# EAGLE schematic mega_simplest_classboard_redux (EAGLE 6.5.0)
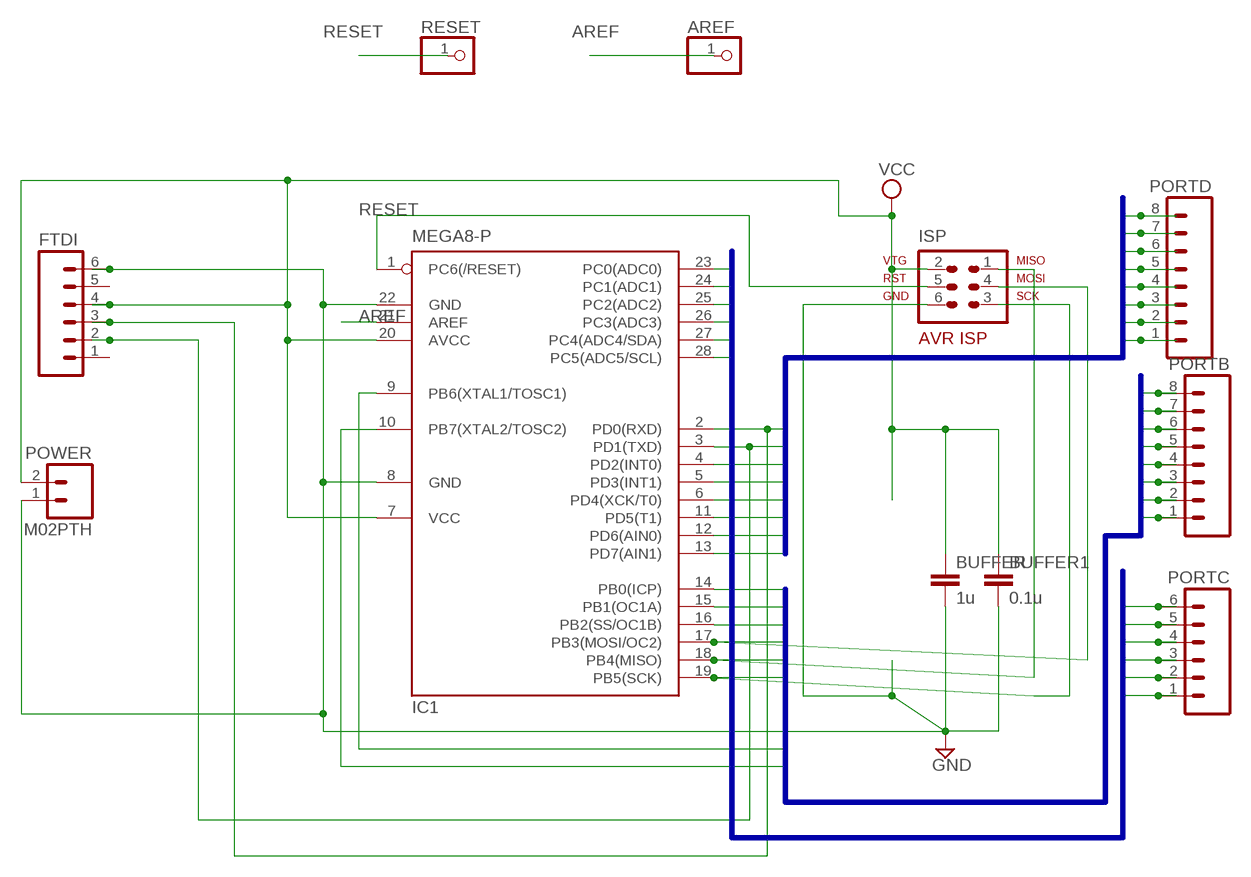
[diagram p0: schematic, sheet 1]

## Parts
AREF  PINHD-1X1  [1X01]
BUFFER  1u  C5/3.5  [C5B3.5]
BUFFER1  0.1u  C5/3.5  [C5B3.5]
FTDI  M06SIP  [1X06]
IC1  MEGA8-P  [DIL28-3]
ISP  AVR-ISP-6  [AVR-ISP-6]
PORTB  M081X08  [1X08]
PORTC  M06SIP  [1X06]
PORTD  M081X08  [1X08]
POWER  M02PTH  [1X02]
RESET  PINHD-1X1  [1X01]

## Nets
AREF: AREF.1 IC1.21(AREF)
GND: BUFFER1.2 BUFFER.2 FTDI.6 IC1.8(GND) IC1.22(GND) ISP.6 POWER.1
PORTB0: IC1.14(PB0(ICP)) PORTB.8
PORTB1: IC1.15(PB1(OC1A)) PORTB.7
PORTB2: IC1.16(PB2(SS/OC1B)) PORTB.6
PORTB3: IC1.17(PB3(MOSI/OC2)) ISP.4 PORTB.5
PORTB4: IC1.18(PB4(MISO)) ISP.1 PORTB.4
PORTB5: IC1.19(PB5(SCK)) ISP.3 PORTB.3
PORTB6: IC1.9(PB6(XTAL1/TOSC1)) PORTB.2
PORTB7: IC1.10(PB7(XTAL2/TOSC2)) PORTB.1
PORTC0: IC1.23(PC0(ADC0)) PORTC.6
PORTC1: IC1.24(PC1(ADC1)) PORTC.5
PORTC2: IC1.25(PC2(ADC2)) PORTC.4
PORTC3: IC1.26(PC3(ADC3)) PORTC.3
PORTC4: IC1.27(PC4(ADC4/SDA)) PORTC.2
PORTC5: IC1.28(PC5(ADC5/SCL)) PORTC.1
PORTD0: FTDI.3 IC1.2(PD0(RXD)) PORTD.8
PORTD1: FTDI.2 IC1.3(PD1(TXD)) PORTD.7
PORTD2: IC1.4(PD2(INT0)) PORTD.6
PORTD3: IC1.5(PD3(INT1)) PORTD.5
PORTD4: IC1.6(PD4(XCK/T0)) PORTD.4
PORTD5: IC1.11(PD5(T1)) PORTD.3
PORTD6: IC1.12(PD6(AIN0)) PORTD.2
PORTD7: IC1.13(PD7(AIN1)) PORTD.1
RESET: IC1.1(PC6(/RESET)) ISP.5 RESET.1
VCC: BUFFER1.1 BUFFER.1 FTDI.4 IC1.7(VCC) IC1.20(AVCC) ISP.2 POWER.2
Unconnected: FTDI.1 FTDI.5

## Buses
PORTD[0..7]
PORTB[0..7]
PORTC[0..5]

## Library data of the parts
AREF RESET = pinhead:PINHD-1X1: PIN HEADER
BUFFER BUFFER1 = capacitor-wima:C: CAPACITOR naming: grid - package width
FTDI PORTC = SparkFun-Connectors:M06: Header 6 Standard 6-pin 0.1" header. Use with straight break away headers (SKU : PRT-00116), right angle break away headers (PRT-00553), swiss pins (PRT-00743), machine pins (PRT-00117), and female headers (PRT-00115). Molex polarized connector foot print use with SKU : PRT-08094 with associated crimp pins and housings. NOTES ON THE VARIANTS LOCK and LOCK_LONGPADS... This footprint was designed to help hold the alignment of a through-hole component (i.e. 6-pin header) while soldering it into place. You may notice that each hole has been shifted either up or down by 0.005 of an inch from it's more standard position (which is a perfectly straight line). This slight alteration caused the pins (the squares in the middle) to touch the edges of the holes. Because they are alternating, it causes a "brace" to hold the component in place. 0.005 has proven to be the perfect amount of "off-center" position when using our standard breakaway headers. Although looks a little odd when you look at the bare footprint, once you have a header in there, the alteration is very hard to notice. Also,if you push a header all the way into place, it is covered up entirely on the bottom side. This idea of altering the position of holes to aid alignment will be further integrated into the Sparkfun Library for other footprints. It can help hold any component with 3 or more connection pins.
IC1 = atmel:MEGA8-P: MICROCONTROLLER 8 Kbytes FLASH, 1 kbytes SRAM, 512 bytes EEPROM, USART, 4-channel 10 bit ADC, 2-channel 8 bit ADC Pin compatible with Atmega48, ATMega88, ATMega168 Source: avr.lbr
ISP = atmel-1:AVR-ISP-6: AVR ISP-6 Serial Programming Header
PORTB PORTD = SparkFun-Connectors:M08: Header 8 Standard 8-pin 0.1" header. Use with straight break away headers (SKU : PRT-00116), right angle break away headers (PRT-00553), swiss pins (PRT-00743), machine pins (PRT-00117), and female headers (PRT-00115).
POWER = SparkFun-Connectors:M02: Standard 2-pin 0.1" header. Use with - straight break away headers ( PRT-00116) - right angle break away headers (PRT-00553) - swiss pins (PRT-00743) - machine pins (PRT-00117) - female headers (PRT-00115) Molex polarized connector foot print use with: PRT-08233 with associated crimp pins and housings. 2.54_SCREWTERM for use with PRT-10571. 3.5mm Screw Terminal footprints for PRT-08084 5mm Screw Terminal footprints for use with PRT-08433